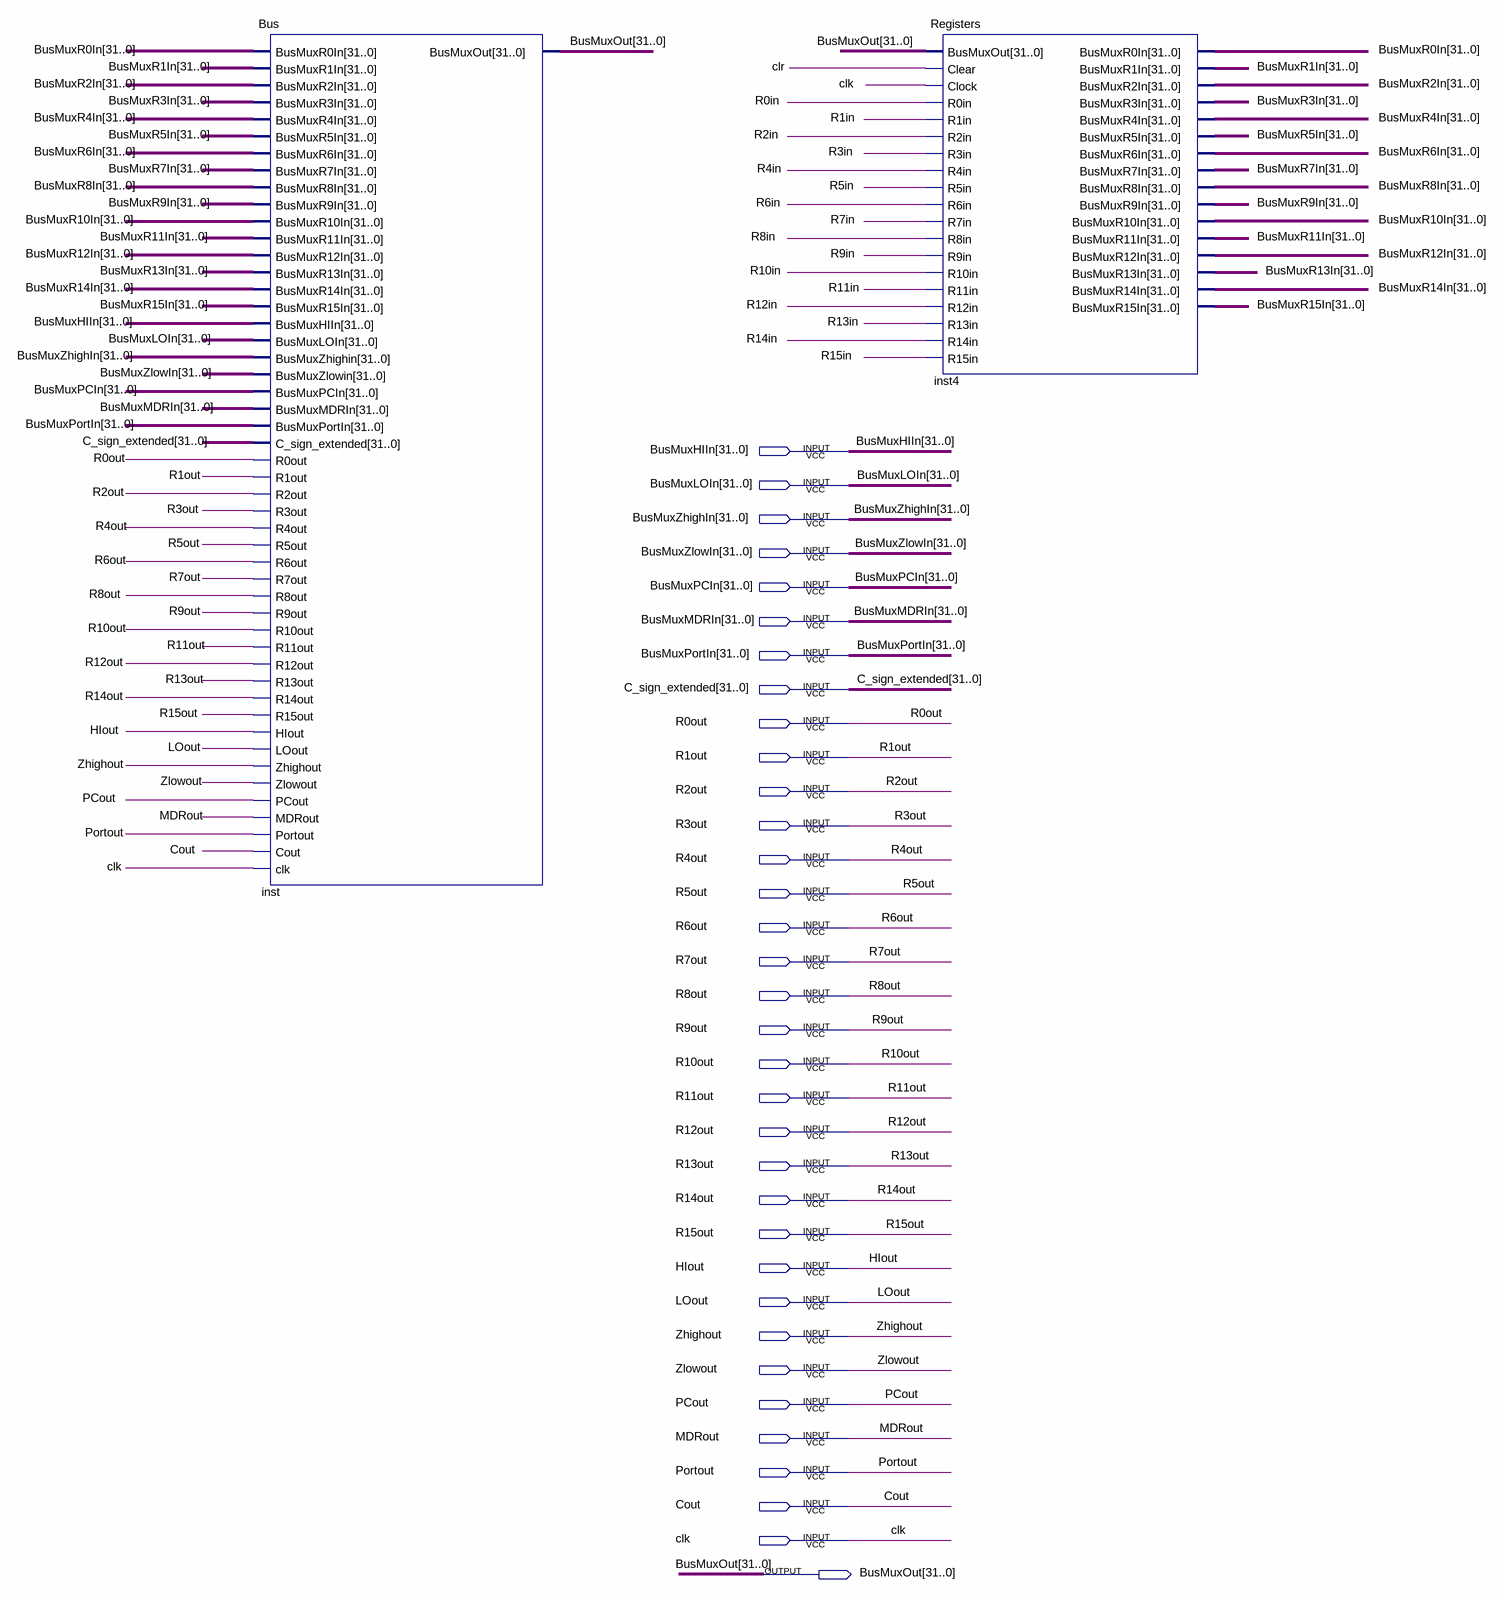
[diagram p0: schematic sheet]
// Quartus schematic Datapath.bdf as structural Verilog: 2 symbols, 34 pins
module Datapath (
  input  [31:0] BusMuxHIIn,
  input  [31:0] BusMuxLOIn,
  input  [31:0] BusMuxZhighIn,
  input  [31:0] BusMuxZlowIn,
  input  [31:0] BusMuxPCIn,
  input  [31:0] BusMuxMDRIn,
  input  [31:0] BusMuxPortIn,
  input  [31:0] C_sign_extended,
  input  R0out,
  input  R1out,
  input  R2out,
  input  R3out,
  input  R4out,
  input  R5out,
  input  R6out,
  input  R7out,
  input  R8out,
  input  R9out,
  input  R10out,
  input  R11out,
  input  R12out,
  input  R13out,
  input  R14out,
  input  R15out,
  input  HIout,
  input  LOout,
  input  Zhighout,
  input  Zlowout,
  input  PCout,
  input  MDRout,
  input  Portout,
  input  Cout,
  input  clk,
  output [31:0] BusMuxOut
);

  wire clr, R0in, R1in, R2in, R3in, R4in, R5in, R6in, R7in, R8in, R9in, R10in, R11in, R12in, R13in, R14in,
       R15in;
  wire [31:0] BusMuxR0In, BusMuxR1In, BusMuxR2In, BusMuxR3In, BusMuxR4In, BusMuxR5In, BusMuxR6In, BusMuxR7In,
       BusMuxR8In, BusMuxR9In, BusMuxR10In, BusMuxR11In, BusMuxR12In, BusMuxR13In, BusMuxR14In, BusMuxR15In;

  Bus inst (
    .BusMuxR0In(BusMuxR0In), .BusMuxR1In(BusMuxR1In), .BusMuxR2In(BusMuxR2In), .BusMuxR3In(BusMuxR3In),
    .BusMuxR4In(BusMuxR4In), .BusMuxR5In(BusMuxR5In), .BusMuxR6In(BusMuxR6In), .BusMuxR7In(BusMuxR7In),
    .BusMuxR8In(BusMuxR8In), .BusMuxR9In(BusMuxR9In), .BusMuxR10In(BusMuxR10In), .BusMuxR11In(BusMuxR11In),
    .BusMuxR12In(BusMuxR12In), .BusMuxR13In(BusMuxR13In), .BusMuxR14In(BusMuxR14In),
    .BusMuxR15In(BusMuxR15In), .BusMuxHIIn(BusMuxHIIn), .BusMuxLOIn(BusMuxLOIn),
    .BusMuxZhighin(BusMuxZhighIn), .BusMuxZlowin(BusMuxZlowIn), .BusMuxPCIn(BusMuxPCIn),
    .BusMuxMDRIn(BusMuxMDRIn), .BusMuxPortIn(BusMuxPortIn), .C_sign_extended(C_sign_extended), .R0out(R0out),
    .R1out(R1out), .R2out(R2out), .R3out(R3out), .R4out(R4out), .R5out(R5out), .R6out(R6out), .R7out(R7out),
    .R8out(R8out), .R9out(R9out), .R10out(R10out), .R11out(R11out), .R12out(R12out), .R13out(R13out),
    .R14out(R14out), .R15out(R15out), .HIout(HIout), .LOout(LOout), .Zhighout(Zhighout), .Zlowout(Zlowout),
    .PCout(PCout), .MDRout(MDRout), .Portout(Portout), .Cout(Cout), .clk(clk), .BusMuxOut(BusMuxOut));
  Registers inst4 (
    .BusMuxOut(BusMuxOut), .Clear(clr), .Clock(clk), .R0in(R0in), .R1in(R1in), .R2in(R2in), .R3in(R3in),
    .R4in(R4in), .R5in(R5in), .R6in(R6in), .R7in(R7in), .R8in(R8in), .R9in(R9in), .R10in(R10in),
    .R11in(R11in), .R12in(R12in), .R13in(R13in), .R14in(R14in), .R15in(R15in), .BusMuxR0In(BusMuxR0In),
    .BusMuxR1In(BusMuxR1In), .BusMuxR2In(BusMuxR2In), .BusMuxR3In(BusMuxR3In), .BusMuxR4In(BusMuxR4In),
    .BusMuxR5In(BusMuxR5In), .BusMuxR6In(BusMuxR6In), .BusMuxR7In(BusMuxR7In), .BusMuxR8In(BusMuxR8In),
    .BusMuxR9In(BusMuxR9In), .BusMuxR10In(BusMuxR10In), .BusMuxR11In(BusMuxR11In), .BusMuxR12In(BusMuxR12In),
    .BusMuxR13In(BusMuxR13In), .BusMuxR14In(BusMuxR14In), .BusMuxR15In(BusMuxR15In));
endmodule
